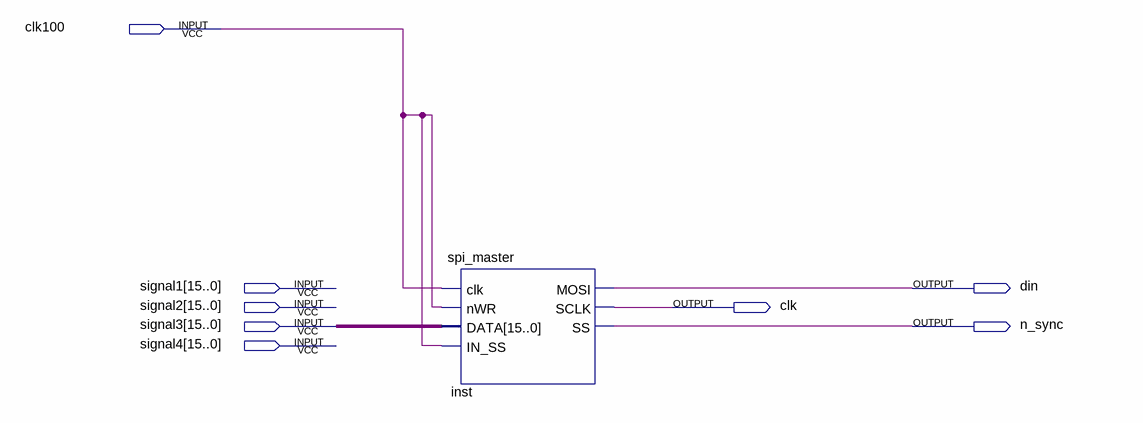
[diagram p0: schematic sheet]
// Quartus schematic DAC_Block.bdf as structural Verilog: 1 symbols, 8 pins
module DAC_Block (
  input  clk100,
  input  [15:0] signal1,
  input  [15:0] signal2,
  input  [15:0] signal3,
  input  [15:0] signal4,
  output din,
  output clk,
  output n_sync
);

  spi_master inst (.clk(clk100), .nWR(clk100), .DATA(signal3), .IN_SS(clk100), .MOSI(din), .SCLK(clk), .SS(n_sync));
endmodule
